# EAGLE board SAME54-Dev (EAGLE 9.5.1)
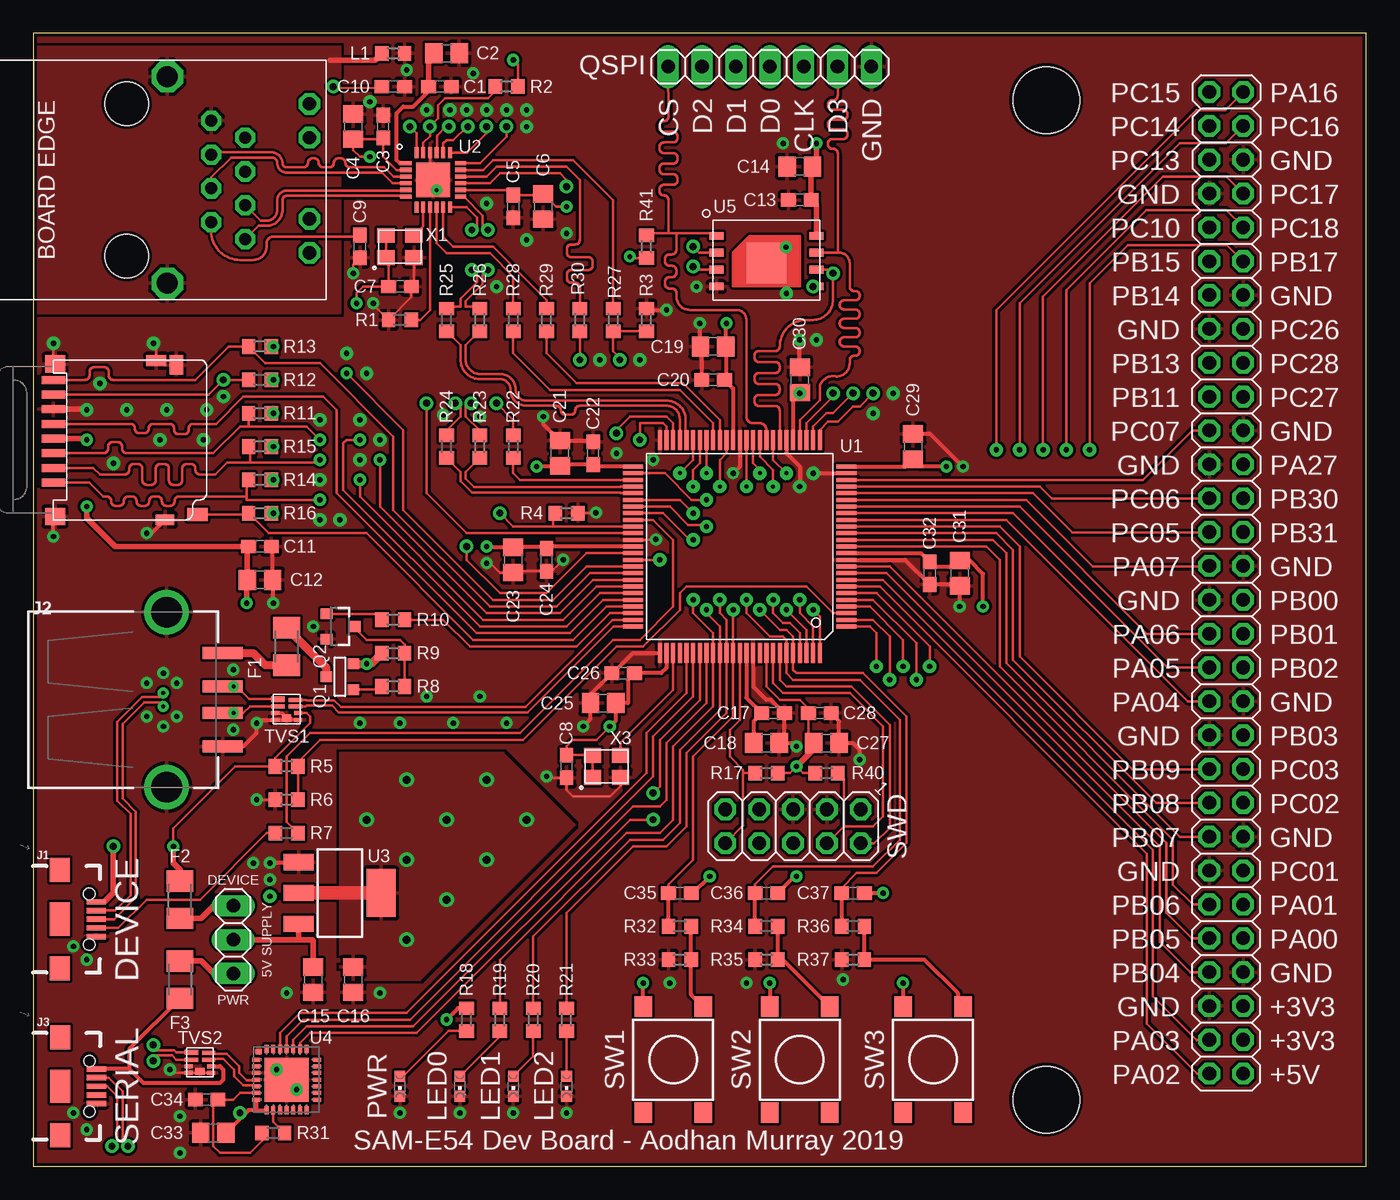
[diagram p3: board, top side]
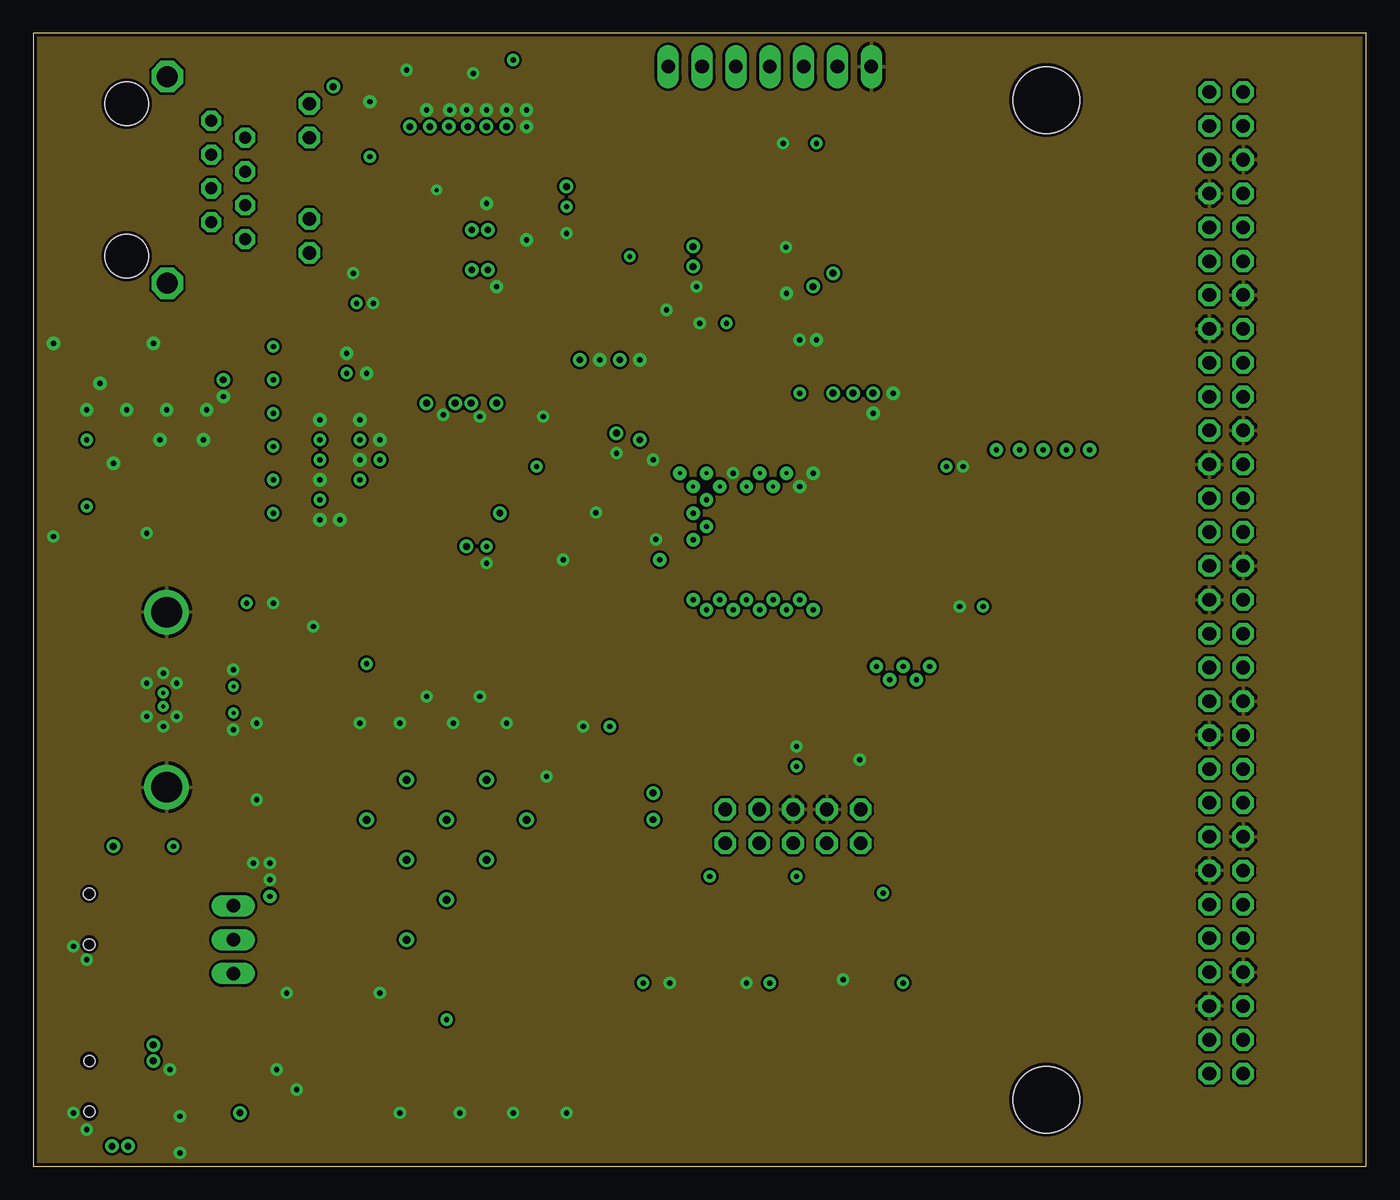
[diagram p4: board, inner layer Route2]
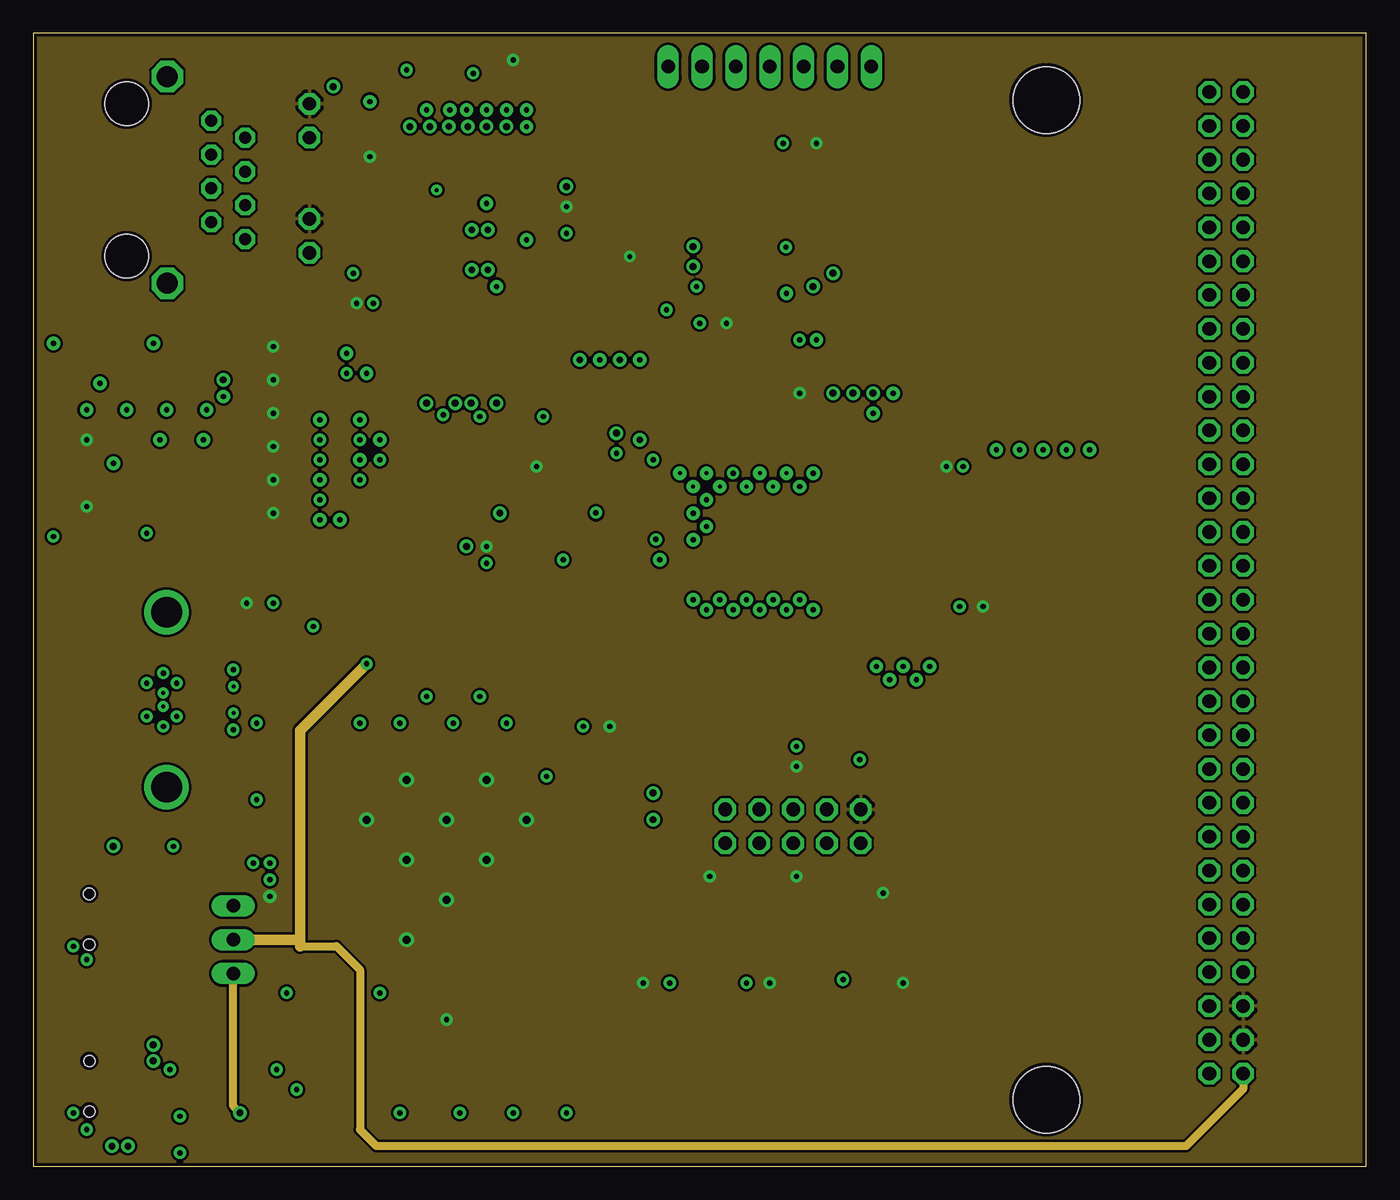
[diagram p5: board, inner layer Route15]
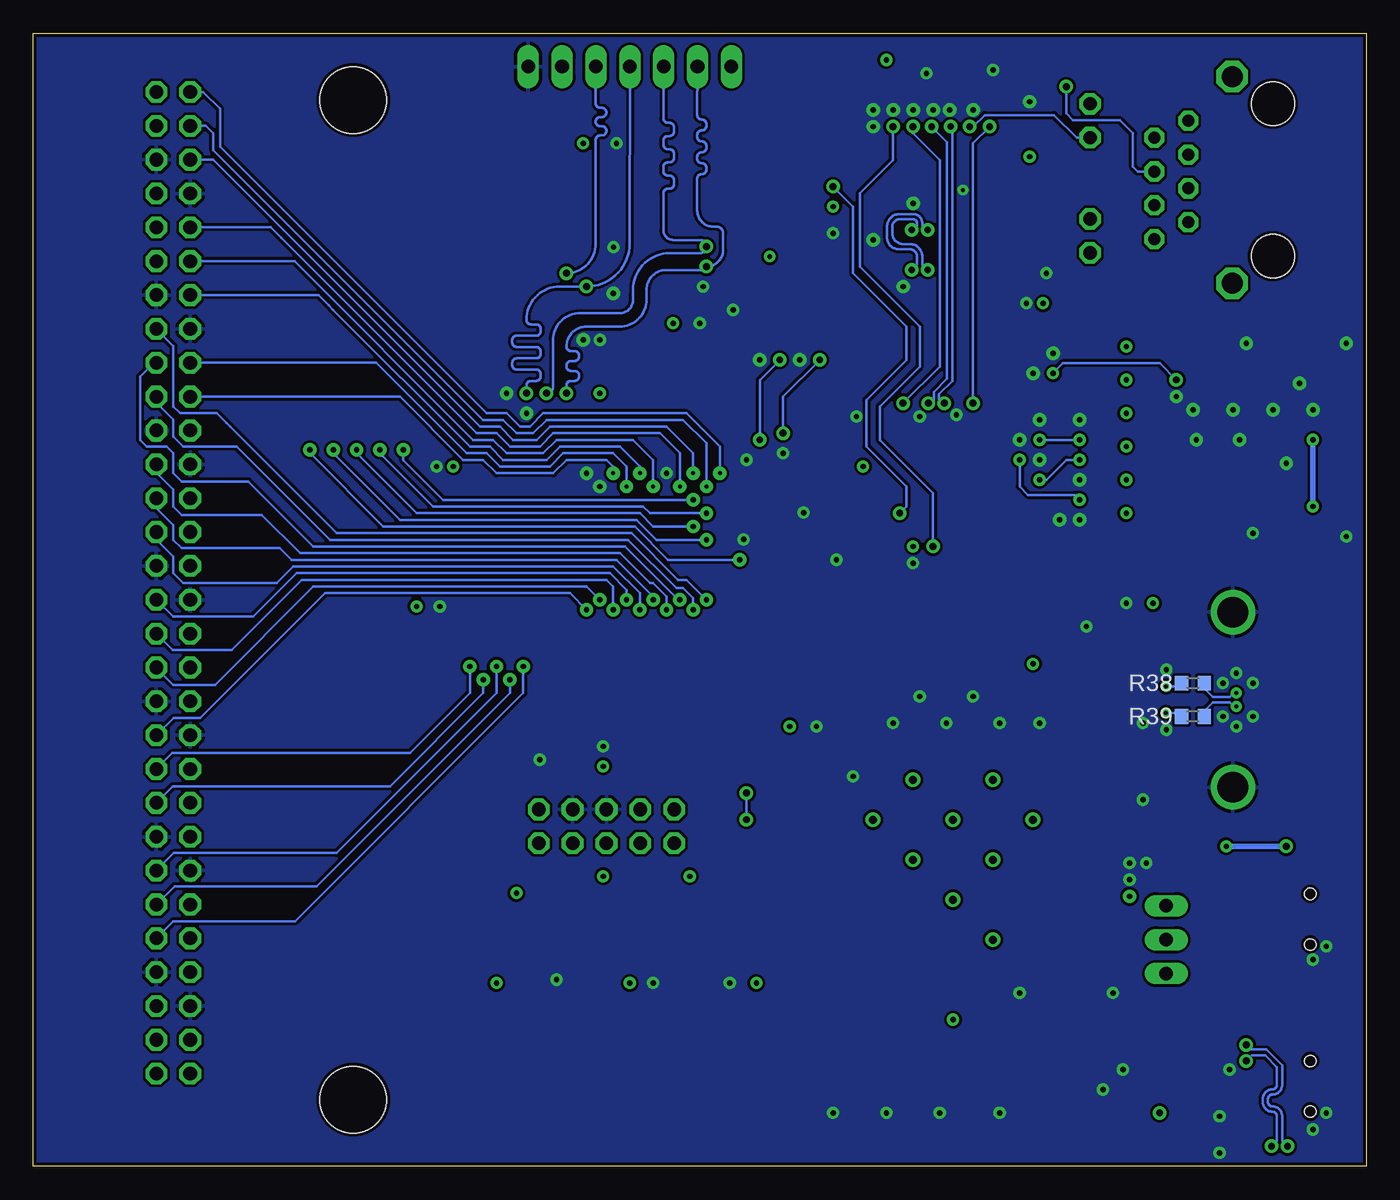
[diagram p6: board, bottom side, seen from below]

Size 100 x 85 mm. Coordinates in mm from the lower left corner, seen from the top.
Outline: 0,0 100,0 100,85 0,85 0,0
Copper layers (1+2*15+16): Top 0.035mm / dielectric 0.2mm / Route2 0.0175mm / dielectric 0.265mm / Route15 0.0175mm / dielectric 0.2mm / Bottom 0.035mm
Design rules "JLC-4Layer *": minimum track width 3.5mil, minimum drill 0.3mm, track to track 3.5mil, track to pad 3.5mil, pad to pad 3.5mil, via to via 3.5mil, smd to smd 0mil, copper to edge 10mil, drill to drill 8mil, minimum pad ring 12mil, minimum via ring 10mil, stop-mask expansion 4mil, vias tented up to drill 0.6mm, thermal gap 10mil
Net classes: 0 default: width 0.2 mm, drill 0.3 mm, clearance 0.191 mm
Holes 5 mm at 76,5 76,80

## Footprints (pad centres in the part's own frame; a part is rotated, then mirrored left to right if it is on the bottom)
C0603 = smd 1.1 x 1: 1 -0.85,0; 2 0.85,0
C0805 = smd 1.3 x 1.5: 1 -0.95,0; 2 0.95,0
M1206 = smd 1.6 x 2: 1 -1.4,0; 2 1.4,0
USB-B-MICRO-SMD_RED_PASTE = smd 1.45 x 0.4: D+ 2.725,0; D- 2.725,0.65; GND 2.725,-1.3; ID 2.725,-0.65; VBUS 2.725,1.3 | smd 1.5 x 1.8: SHIELD1 0,3.685; SHIELD2 0,-3.685 | smd 1.5 x 2.5: SHIELD3 0,0 | hole 0.85: 2.2,1.9; 2.2,-1.9
USB-A-S-SILK-FEMALE = smd 3 x 0.9: D+ 7.212,-1; D- 7.212,1; GND 7.212,-3.5; VBUS 7.212,3.5 | drill 2.311: SHLD1 3,-6.566; SHLD2 3,6.566
1X03 = drill 1.016 long: 1 -2.54,0; 2 0,0; 3 2.54,0
2X30 = drill 1.016 octagon: 1 -38.1,-1.27; 2 -38.1,1.27; 3 -35.56,-1.27; 4 -35.56,1.27; 5 -33.02,-1.27; 6 -33.02,1.27; 7 -30.48,-1.27; 8 -30.48,1.27; 9 -27.94,-1.27; 10 -27.94,1.27; 11 -25.4,-1.27; 12 -25.4,1.27; 13 -22.86,-1.27; 14 -22.86,1.27; 15 -20.32,-1.27; 16 -20.32,1.27; 17 -17.78,-1.27; 18 -17.78,1.27; 19 -15.24,-1.27; 20 -15.24,1.27; 21 -12.7,-1.27; 22 -12.7,1.27; 23 -10.16,-1.27; 24 -10.16,1.27; 25 -7.62,-1.27; 26 -7.62,1.27; 27 -5.08,-1.27; 28 -5.08,1.27; 29 -2.54,-1.27; 30 -2.54,1.27; 31 0,-1.27; 32 0,1.27; 33 2.54,-1.27; 34 2.54,1.27; 35 5.08,-1.27; 36 5.08,1.27; 37 7.62,-1.27; 38 7.62,1.27; 39 10.16,-1.27; 40 10.16,1.27; 41 12.7,-1.27; 42 12.7,1.27; 43 15.24,-1.27; 44 15.24,1.27; 45 17.78,-1.27; 46 17.78,1.27; 47 20.32,-1.27; 48 20.32,1.27; 49 22.86,-1.27; 50 22.86,1.27; 51 25.4,-1.27; 52 25.4,1.27; 53 27.94,-1.27; 54 27.94,1.27; 55 30.48,-1.27; 56 30.48,1.27; 57 33.02,-1.27; 58 33.02,1.27; 59 35.56,-1.27; 60 35.56,1.27
R0603 = smd 1 x 1.1: 1 -0.85,0; 2 0.85,0
CHIPLED_0603 = smd 0.8 x 0.8: A 0,-0.75; C 0,0.75
SOT-23 = smd 0.787 x 0.889: 1 0.025,-1.016; 2 -0.94,1.016; 3 0.991,1.016
SOT23-3 = smd 0.8 x 0.9: 1 -0.95,-1; 2 0.95,-1; 3 0,1.1
1X07 = drill 1.016 long: 1 -7.62,0; 2 -5.08,0; 3 -2.54,0; 4 0,0; 5 2.54,0; 6 5.08,0; 7 7.62,0
TACTILE_SWITCH_SMD_6.2MM_TALL = smd 1.55 x 1.3: A1 -3.975,-2.25; A2 3.975,-2.25; B1 -3.975,2.25; B2 3.975,2.25
2X05 = drill 1.016 octagon: 1 -5.08,-1.27; 2 -5.08,1.27; 3 -2.54,-1.27; 4 -2.54,1.27; 5 0,-1.27; 6 0,1.27; 7 2.54,-1.27; 8 2.54,1.27; 9 5.08,-1.27; 10 5.08,1.27
WDFN8 = smd 0.4 x 1: 1 -0.05,-0.65 | smd 0.3 x 1: 2 0.5,-0.65; 7 0.5,0.65; 8 0,0.65 | smd 0.3 x 0.6: 3 1,-0.85; 4 1.5,-0.85; 5 1.5,0.85; 6 1,0.85 | smd 0.54 x 0.7: PAD 1.38,0
TQFP100 = smd 1.5 x 0.3: 1 -8,6; 2 -8,5.5; 3 -8,5; 4 -8,4.5; 5 -8,4; 6 -8,3.5; 7 -8,3; 8 -8,2.5; 9 -8,2; 10 -8,1.5; 11 -8,1; 12 -8,0.5; 13 -8,0; 14 -8,-0.5; 15 -8,-1; 16 -8,-1.5; 17 -8,-2; 18 -8,-2.5; 19 -8,-3; 20 -8,-3.5; 21 -8,-4; 22 -8,-4.5; 23 -8,-5; 24 -8,-5.5; 25 -8,-6; 51 8,-6; 52 8,-5.5; 53 8,-5; 54 8,-4.5; 55 8,-4; 56 8,-3.5; 57 8,-3; 58 8,-2.5; 59 8,-2; 60 8,-1.5; 61 8,-1; 62 8,-0.5; 63 8,0; 64 8,0.5; 65 8,1; 66 8,1.5; 67 8,2; 68 8,2.5; 69 8,3; 70 8,3.5; 71 8,4; 72 8,4.5; 73 8,5; 74 8,5.5; 75 8,6 | smd 0.3 x 1.5: 26 -6,-8; 27 -5.5,-8; 28 -5,-8; 29 -4.5,-8; 30 -4,-8; 31 -3.5,-8; 32 -3,-8; 33 -2.5,-8; 34 -2,-8; 35 -1.5,-8; 36 -1,-8; 37 -0.5,-8; 38 0,-8; 39 0.5,-8; 40 1,-8; 41 1.5,-8; 42 2,-8; 43 2.5,-8; 44 3,-8; 45 3.5,-8; 46 4,-8; 47 4.5,-8; 48 5,-8; 49 5.5,-8; 50 6,-8; 76 6,8; 77 5.5,8; 78 5,8; 79 4.5,8; 80 4,8; 81 3.5,8; 82 3,8; 83 2.5,8; 84 2,8; 85 1.5,8; 86 1,8; 87 0.5,8; 88 0,8; 89 -0.5,8; 90 -1,8; 91 -1.5,8; 92 -2,8; 93 -2.5,8; 94 -3,8; 95 -3.5,8; 96 -4,8; 97 -4.5,8; 98 -5,8; 99 -5.5,8; 100 -6,8
QFN24 = smd 0.85 x 0.3: 1 -2.05,1.25; 2 -2.05,0.75; 3 -2.05,0.25; 4 -2.05,-0.25; 5 -2.05,-0.75; 6 -2.05,-1.25; 13 2.05,-1.25; 14 2.05,-0.75; 15 2.05,-0.25; 16 2.05,0.25; 17 2.05,0.75; 18 2.05,1.25 | smd 0.3 x 0.85: 7 -1.25,-2.05; 8 -0.75,-2.05; 9 -0.25,-2.05; 10 0.25,-2.05; 11 0.75,-2.05; 12 1.25,-2.05; 19 1.25,2.05; 20 0.75,2.05; 21 0.25,2.05; 22 -0.25,2.05; 23 -0.75,2.05; 24 -1.25,2.05 | smd 2.55 x 2.55: PAD 0,0
SOT223 = smd 1.219 x 2.235: 1 -2.311,-3.099; 2 0,-3.099; 3 2.311,-3.099 | smd 3.6 x 2.2: 4 0,3.099
MLP28 = smd 0.6 x 0.3: 1 -2.3,1.5; 2 -2.3,1; 3 -2.3,0.5; 4 -2.3,0; 5 -2.3,-0.5; 6 -2.3,-1; 7 -2.3,-1.5; 15 2.3,-1.5; 16 2.3,-1; 17 2.3,-0.5; 18 2.3,0; 19 2.3,0.5; 20 2.3,1; 21 2.3,1.5 | smd 0.3 x 0.6: 8 -1.5,-2.3; 9 -1,-2.3; 10 -0.5,-2.3; 11 0,-2.3; 12 0.5,-2.3; 13 1,-2.3; 14 1.5,-2.3; 22 1.5,2.3; 23 1,2.3; 24 0.5,2.3; 25 0,2.3; 26 -0.5,2.3; 27 -1,2.3; 28 -1.5,2.3 | smd 3.3 x 3.3: EXP 0,0 | smd 0.435 x 0.435: M -2.103,2.103
WSON8 = smd 1.05 x 0.57: 1 -3.75,3.81; 2 -3.75,2.54; 3 -3.75,1.27; 4 -3.75,0; 5 3.75,0; 6 3.75,1.27; 7 3.75,2.54; 8 3.75,3.81 | smd 3 x 3: PAD 0,1.75
ASE = smd 1.3 x 1.1: 1 -1.05,-0.825; 2 1.05,-0.825; 3 1.05,0.825; 4 -1.05,0.825
SI-50170-F = drill 0.9 octagon: 1 4.445,8.89; 2 3.175,6.35; 3 1.905,8.89; 4 0.635,6.35; 5 -0.635,8.89; 6 -1.905,6.35; 7 -3.175,8.89; 8 -4.445,6.35 | drill 1 octagon: LED-GREEN+ 2.925,13.72; LED-GREEN- 5.465,13.72; YELLOW+ -5.715,13.72; YELLOW- -3.175,13.72 | drill 1.57 octagon: SHIELD1 -7.755,3.05; SHIELD2 7.755,3.05 | hole 3.25: -5.715,0; 5.715,0
DM3D-SF = smd 0.6 x 1.75: 1 7.7,0; 2 6.6,0; 3 5.5,0; 4 4.4,0; 5 3.3,0; 6 2.2,0; 7 1.1,0; 8 0,0 | smd 1 x 1.55: CDA 10.1,10.8 | smd 0.8 x 1.5: CDB -1.45,7.725 | smd 1.3 x 1.5: SHIELD -1.2,0.125; SHIELD1 10.25,0.125 | smd 0.8 x 1.4: SHIELD2 10.5,8.375 | smd 1.45 x 1: SHIELD3 -1.125,9.225

## Placement (x,y rotation side)
C1  100n  [C0603]  30.5,81 0 top
C2  2.2u  [C0805]  31,83.5 0 top
C3  100n  [C0603]  26.25,78 90 top
C4  22u  [C0805]  24,78 90 top
C5  100n  [C0603]  36,72 270 top
C6  22u  [C0805]  38.25,72 270 top
C7  100n  [C0603]  27.5,66 0 top
C8  100n  [C0603]  40,30 270 top
C9  100n  [C0603]  24.5,69 270 top
C10  100n  [C0603]  27,81 0 top
C11  100n  [C0603]  17,46.5 0 top
C12  10u  [C0805]  17,44 0 top
C13  100n  [C0603]  57.5,72.5 180 top
C14  10u  [C0805]  57.5,75 180 top
C15  10u  [C0805]  21,14 270 top
C16  22u  [C0805]  24,14 270 top
C17  100n  [C0603]  55.5,34 0 top
C18  4.7u  [C0805]  55,31.75 0 top
C19  10u  [C0805]  51,61.5 180 top
C20  100n  [C0603]  51,59 180 top
C21  10u  [C0805]  39.5,53.5 90 top
C22  100n  [C0603]  42,53.5 90 top
C23  10u  [C0805]  36,45.5 270 top
C24  100n  [C0603]  38.5,45.5 270 top
C25  10u  [C0805]  42.75,34.75 180 top
C26  100n  [C0603]  44.25,37 180 top
C27  10u  [C0805]  59.5,31.75 0 top
C28  100n  [C0603]  59,34 0 top
C29  1u  [C0805]  66,54 90 top
C30  1u  [C0805]  57.5,59 90 top
C31  10u  [C0805]  69.5,44.5 270 top
C32  100n  [C0603]  67.25,44.5 270 top
C33  1u  [C0805]  13.5,2.5 180 top
C34  0.1u  [C0603]  13,5 180 top
C35  100n  [C0603]  48.5,20.5 180 top
C36  100n  [C0603]  55,20.5 180 top
C37  100n  [C0603]  61.5,20.5 180 top
F1  1.5A  [M1206]  19,39 90 top
F2  1.5A  [M1206]  11,20 270 top
F3  1.5A  [M1206]  11,14 90 top
J1  [USB-B-MICRO-SMD_RED_PASTE]  1.99,18.53 0 top
J2  USB_A_FEMALE  [USB-A-S-SILK-FEMALE]  7,35 0 top
J3  [USB-B-MICRO-SMD_RED_PASTE]  2,6 0 top
JP2  [1X03]  15,17 90 top
JP4  [2X30]  89.5,42.5 270 top
L1  BLM18PG471SN1D  [R0603]  27,83.5 180 top
LED0  [CHIPLED_0603]  32,6 180 top
LED1  [CHIPLED_0603]  36,6 180 top
LED2  [CHIPLED_0603]  40,6 180 top
PWR  [CHIPLED_0603]  27.5,6 180 top
Q1  [SOT-23]  23,36.75 270 top
Q2  [SOT23-3]  23,40.5 270 top
QSPI  [1X07]  55.25,82.5 0 top
R1  6.49k  [R0603]  27.5,63.5 0 top
R2  4.7k  [R0603]  35.5,81 0 top
R3  1k  [R0603]  46,63.5 270 top
R4  1k  [R0603]  40,49 180 top
R5  30k  [R0603]  19,30 180 top
R6  47k  [R0603]  19,27.5 0 top
R7  330  [R0603]  19,25 180 top
R8  330  [R0603]  27,36 0 top
R9  1k  [R0603]  27,38.5 180 top
R10  1k  [R0603]  27,41 0 top
R11  10k  [R0603]  17,56.5 0 top
R12  100k  [R0603]  17,59 0 top
R13  100k  [R0603]  17,61.5 0 top
R14  100k  [R0603]  17,51.5 0 top
R15  100k  [R0603]  17,54 0 top
R16  10k  [R0603]  17,49 0 top
R17  10k  [R0603]  55,29.5 180 top
R18  330  [R0603]  32.5,11 90 top
R19  330  [R0603]  35,11 90 top
R20  330  [R0603]  37.5,11 90 top
R21  330  [R0603]  40,11 90 top
R22  0R  [R0603]  36,54 90 top
R23  0R  [R0603]  33.5,54 90 top
R24  0R  [R0603]  31,54 90 top
R25  0R  [R0603]  31,63.5 90 top
R26  0R  [R0603]  33.5,63.5 90 top
R27  0R  [R0603]  43.5,63.5 90 top
R28  0R  [R0603]  36,63.5 90 top
R29  0R  [R0603]  38.5,63.5 90 top
R30  0R  [R0603]  41,63.5 90 top
R31  10k  [R0603]  18,2.5 0 top
R32  10k  [R0603]  48.5,18 180 top
R33  100k  [R0603]  48.5,15.5 0 top
R34  10k  [R0603]  55,18 180 top
R35  100k  [R0603]  55,15.5 0 top
R36  10k  [R0603]  61.5,18 180 top
R37  100k  [R0603]  61.5,15.5 0 top
R38  0  [R0603]  13,36.25 180 bottom
R39  0  [R0603]  13,33.75 180 bottom
R40  1k  [R0603]  59.5,29.5 180 top
R41  100k  [R0603]  46,69 270 top
SW1  [TACTILE_SWITCH_SMD_6.2MM_TALL]  48,8 90 top
SW2  [TACTILE_SWITCH_SMD_6.2MM_TALL]  57.5,8 90 top
SW3  [TACTILE_SWITCH_SMD_6.2MM_TALL]  67.5,8 90 top
SWD  [2X05]  57,25.5 180 top
TVS1  EMI2121MT  [WDFN8]  19,35 270 top
TVS2  EMI2121MT  [WDFN8]  12.5,8.5 270 top
U1  ATSAME54N20A  [TQFP100]  53,46.5 180 top
U2  KSZ8091RNA  [QFN24]  30,74 0 top
U3  AP1117  [SOT223]  23,20.5 270 top
U4  CP2102  [MLP28]  19,6.5 0 top
U5  W25N01GV  [WSON8]  55,66 0 top
X1  ASE  [ASE]  27.5,69 0 top
X2  SI-50170-F  [SI-50170-F]  7,74 270 top
X3  ASE  [ASE]  43,30 0 top
X4  DM3D-SF  [DM3D-SF]  1.5,59 270 top

## Tracks (layer width: path | path; a pad name or v marks a point on that pad's centre or on a via)
1-PC15  (via drill 0.3 pad 1)
  Top 0.2: U1.45 49.5,53 v48.5,52
  Bottom 0.2: v48.5,52 48.5,54 51,56.5 61.75,56.5 62.75,55.5 63.5,55.5 64.5,56.5 66,56.5 86,76.5 86,79.33 87.27,80.6 JP4.1
2-PC14  (via drill 0.3 pad 1)
  Top 0.2: U1.44 50,52.75 49.5,52.25 v49.5,51
  Bottom 0.2: v49.5,51 49.5,54.25 51.25,56 61.5,56 62.5,55 63.75,55 64.75,56 66.25,56 86.5,76.25 86.5,77.5 87.06,78.06 JP4.3
3-PC13  (via drill 0.3 pad 1)
  Top 0.2: U1.43 v50.5,52
  Bottom 0.2: v50.5,52 50.5,53.5 52.5,55.5 61.25,55.5 62.25,54.5 64,54.5 65,55.5 66.5,55.5 86.52,75.52 JP4.5
4-PC10  (via drill 0.3 pad 1)
  Top 0.2: U1.40 52,53.5 51.5,53 v51.5,51
  Bottom 0.2: v51.5,51 51.5,53.5 53,55 61,55 62,54 64.25,54 65.25,55 66.75,55 81.42,69.67 82.19,70.44 JP4.9
5-PB15  (via drill 0.3 pad 1)
  Top 0.2: U1.37 v53.5,51
  Bottom 0.2: v53.5,51 53.5,53 55,54.5 60.75,54.5 61.75,53.5 64.5,53.5 65.5,54.5 67,54.5 80.4,67.9 JP4.11
6-PB14  (via drill 0.3 pad 1)
  Top 0.2: v54.5,52 54.5,52.25 54,52.75 U1.36
  Bottom 0.2: v54.5,52 54.5,52.5 56,54 60.5,54 61.5,53 64.75,53 65.75,54 67.25,54 77.5,64.25 77.84,64.59 78.61,65.36 JP4.13
7-PB13  (via drill 0.3 pad 1)
  Top 0.2: U1.35 54.5,53.25 55.5,52.25 v55.5,51
  Bottom 0.2: v55.5,51 55.5,52.5 56.5,53.5 60.25,53.5 61.25,52.5 65,52.5 66,53.5 67.5,53.5 74.28,60.28 JP4.17
8-PB11  (via drill 0.3 pad 1)
  Top 0.2: U1.33 55.5,53 v56.5,52
  Bottom 0.2: v56.5,52 56.5,52.5 57,53 60,53 61,52 65.25,52 66.25,53 67.75,53 72.5,57.75 JP4.19
9-PC07
  Top 0.2: U1.23 83.25,51.5 86.95,55.2 JP4.21
10-PC06
  Top 0.2: U1.22 75.5,51 76.4,50.1 88.21,50.1 JP4.25
11-PC05
  Top 0.2: U1.21 75,50.5 77.94,47.56 88.21,47.56 JP4.27
12-PA07
  Top 0.2: U1.20 74.5,50 79.5,45 88.19,45 JP4.29
13-PA06
  Top 0.2: U1.19 74,49.5 83.56,39.94 88.21,39.94 JP4.33
14-PA05
  Top 0.2: U1.18 73.5,49 85.08,37.42 JP4.35
15-PA04
  Top 0.2: U1.17 73,48.5 86.62,34.88 JP4.37
16-PB09
  Top 0.2: U1.16 72.5,48 74,46.5 74,38.25 82.47,29.78 88.21,29.78 JP4.41
17-PB08
  Top 0.2: U1.15 72.25,47.5 73.5,46.25 73.5,38 84.26,27.24 88.21,27.24 JP4.43
18-PB07
  Top 0.2: U1.14 72,47 73,46 73,37.75 86.03,24.72 JP4.45
19-PB06
  Top 0.2: U1.13 71.5,46.5 72.5,45.5 72.5,37.5 85.5,24.5 85.5,21.12 86.98,19.64 JP4.49
20-PB05
  Top 0.2: U1.10 64.25,45 85,24.25 85,19 86.9,17.1 JP4.51
21-PB04
  Top 0.2: U1.9 64,44.5 84.5,24 84.5,16.83 86.79,14.54 88.21,14.54 JP4.53
22-PA03
  Top 0.2: U1.8 63.75,44 84,23.75 84,12.75 87.29,9.46 87.31,9.48 JP4.57
23-PA02
  Top 0.2: U1.7 63.5,43.5 83.56,23.44 83.56,10.69 87.33,6.92 87.35,6.94 JP4.59
24-PC03  (via drill 0.4 pad 1)
  Top 0.2: U1.6 63.25,43 67.25,39 v67.25,37.5
  Bottom 0.2: v67.25,37.5 67.25,35.5 71.75,31 89.57,31 JP4.42
25-PC02  (via drill 0.4 pad 1)
  Top 0.2: U1.5 63,42.5 66.25,39.25 v66.25,36.5
  Bottom 0.2: v66.25,36.5 66.25,35.5 73.25,28.5 89.53,28.5 JP4.44
26-PC01  (via drill 0.4 pad 1)
  Top 0.2: U1.4 62.75,42 65.25,39.5 v65.25,37.5
  Bottom 0.2: v65.25,37.5 65.25,35.5 77.25,23.5 89.45,23.5 JP4.48
27-PA01  (via drill 0.4 pad 1)
  Top 0.2: U1.2 63,41 64.25,39.75 v64.25,36.5
  Bottom 0.2: v64.25,36.5 64.25,35.5 78.75,21 89.41,21 JP4.50
28-PA00  (via drill 0.4 pad 1)
  Top 0.2: U1.1 62.75,40.5 63.25,40 v63.25,37.5
  Bottom 0.2: v63.25,37.5 63.25,35.5 80.38,18.38 89.5,18.38 JP4.52
29-PB03  (via drill 0.4 pad 1)
  Top 0.2: U1.100 59,41.25 v58.5,41.75
  Bottom 0.2: v58.5,41.75 59.75,43 78.12,43 87.5,33.62 89.48,33.62 JP4.40
30-PB02  (via drill 0.4 pad 1)
  Top 0.2: U1.99 58.5,40.5 57.5,41.5 v57.5,42.5
  Bottom 0.2: v57.5,42.5 58.5,43.5 79,43.5 86.38,36.12 89.5,36.12 90.77,37.4 JP4.36
31-PB01  (via drill 0.4 pad 1)
  Top 0.2: U1.98 58,40.25 v56.5,41.75
  Bottom 0.2: v56.5,41.75 56.5,43.5 57,44 79.88,44 85.12,38.75 89.56,38.75 JP4.34
32-PB00  (via drill 0.4 pad 1)
  Top 0.2: U1.97 57.5,40 56.75,40.75 56.25,40.75 55.5,41.5 v55.5,42.5
  Bottom 0.2: v55.5,42.5 55.5,43.25 56.75,44.5 80.25,44.5 83.5,41.25 89.52,41.25 JP4.32
33-PB31  (via drill 0.4 pad 1)
  Top 0.2: v54.5,41.75 56,40.25 56.5,40.25 57,39.75 U1.96 57,37.25 57.25,37 62.25,37 65.5,33.75 65.5,24.25 63.25,22 61.75,22 60.65,20.9 C37.2
  Top 0.3: R36.2 C37.2
  Bottom 0.2: v54.5,41.75 54.5,43 56.5,45 80.5,45 81.75,43.75 88.75,43.75 89.5,44.5 89.5,45.75 90.77,47.02 JP4.28
34-PB30  (via drill 0.4 pad 1)
  Top 0.2: v53.5,42.5 53.5,41.5 55.25,39.75 56.25,39.75 56.5,39.5 U1.95 56.5,37 57,36.5 62,36.5 65,33.5 65,24.5 63,22.5 55.5,22.5 54.15,21.15 C36.2
  Top 0.3: R34.2 C36.2
  Bottom 0.2: v53.5,42.5 53.5,42.75 56.25,45.5 80.63,45.5 81.5,46.38 88.88,46.38 89.5,47 89.5,48.1 90.77,49.37 JP4.26
35-PA27  (via drill 0.4 pad 1)
  Top 0.2: C35.2 47.65,21.15 49.5,23 49.5,30.75 52.5,33.75 U1.87 v52.5,41.75
  Top 0.3: R32.2 C35.2
  Bottom 0.2: v52.5,41.75 52.5,42.75 53.5,43.75 53.75,43.75 56,46 80,46 82.88,48.88 88.88,48.88 89.5,49.5 89.5,50.77 90.77,52.03 JP4.24
36-PC28  (via drill 0.4 pad 1)
  Top 0.2: R21.2 40,19 45,24 47.5,24 49,25.5 49,31 52,34 U1.86 52,41 51.5,41.5 v51.5,42.5
  Bottom 0.2: v51.5,42.5 51.5,42.38 55.62,46.5 79,46.5 83.88,51.38 88.88,51.38 89.5,52 89.5,53.5 90,54 91.5,54 92,54.5 92,59.25 90.97,60.28 JP4.18
37-PC27  (via drill 0.4 pad 1)
  Top 0.2: R20.2 37.5,17.25 44.75,24.5 47.25,24.5 48.5,25.75 48.5,31.25 51.5,34.25 U1.85 51.5,40.5 50.5,41.5 v50.5,41.75
  Bottom 0.2: v50.5,41.75 50.5,42.62 51.25,43.38 51.75,43.38 55.38,47 77.75,47 84.75,54 88.75,54 89.5,54.75 89.5,56.01 90.77,57.28 JP4.20
38-PC26  (via drill 0.4 pad 1)
  Top 0.2: R19.2 35,15.5 44.5,25 47,25 48,26 48,31.5 51,34.5 U1.84 51,40 49.5,41.5 v49.5,42.5
  Bottom 0.2: v49.5,42.5 51,44 51.62,44 55.12,47.5 77.25,47.5 85.25,55.5 85.5,55.75 86.25,56.5 89,56.5 89.5,57 89.5,61.55 JP4.16
39-PB17  (via drill 0.4 pad 1)
  Top 0.2: U1.65 v47,45.5 | v79.25,53.75 79.25,66.25 82.12,69.12 89.55,69.12 JP4.12
  Bottom 0.2: v47,45.5 52.38,45.5 54.88,48 73.75,48 79.25,53.5 v79.25,53.75
42-PC18  (via drill 0.4 pad 1)
  Top 0.2: U1.58 47.25,49 49.25,47 v49.5,47 | v77.5,53.75 77.5,65.75 83.5,71.75 89.5,71.75 90.77,70.48 JP4.10
  Bottom 0.2: v49.5,47 53.25,47 54.75,48.5 72.5,48.5 77.5,53.5 v77.5,53.75
43-PC17  (via drill 0.4 pad 1)
  Top 0.2: U1.57 47.75,49.5 49.12,48.12 50.38,48.12 v50.5,48 | v75.75,53.75 75.75,65.25 84.75,74.25 89.5,74.25 JP4.8
  Bottom 0.2: v50.5,48 53.5,48 54.5,49 71.25,49 75.75,53.5 v75.75,53.75
44-PC16  (via drill 0.4 pad 1)
  Top 0.2: U1.56 48.5,50 v49.5,49 | v74,53.75 74,64.75 86,76.75 89.46,76.75 JP4.4
  Bottom 0.2: v49.5,49 53.75,49 54.25,49.5 70,49.5 74.12,53.62 v74,53.75
45-PA16  (via drill 0.4 pad 1)
  Top 0.2: U1.52 47.38,52 49.38,50 v50.5,50 | v72.25,53.75 72.25,64.25 87.25,79.25 89.42,79.25 JP4.2
  Bottom 0.2: v50.5,50 69.25,50 72.25,53 v72.25,53.75
+3V3  (via drill 0.35, 0.4, 0.4 pad 1, 0.6)
  Top 0.2: U2.14 35.6,73.25 C5.1 38.15,72.85 C6.1 39.2,72 v40,72 | U2.2 27.25,74.75 26.25,75.75 C3.1 26.15,77.05 C4.1 24,76.25 24.5,75.75 v25.25,75.75 | U1.92 55,36 56,35 57.5,35 58.15,34.35 C28.1 58.15,32.15 C27.1 | R2.2 36.35,82.65 v36,83 | v24.25,64.75 24.25,65.5 24.75,66 C7.1 26.65,67.97 X1.1 X1.4 | R17.1 56.75,29.5 v57.25,30 57.75,29.5 R40.2 | X3.1 X3.4 41.92,30.85 C8.1 40,31.5 40.5,32 42.25,32 v43.25,33 | R15.2 v18,54 | R12.2 v18,59 | R16.2 v18,49 | C30.1 v57.5,58 | R11.2 v18,56.5 | R13.2 v18,61.5 | R14.2 v18,51.5 | R41.2 46,68.12 44.75,68.12 v44.75,68.25
  Top 0.3: U1.77 47.5,37.4 47.1,37 C26.1 44.6,36.5 44.6,34.75 C25.1 43.7,33.45 v43.25,33 | U1.63 38.65,46.5 C24.1 38.9,46.45 C23.1 34.05,46.45 v34,46.5 | U1.51 42.15,52.5 C22.1 39.6,52.65 C21.1 37.8,52.55 v37.75,52.5 | U1.25 65.45,52.5 C29.1 66.55,52.5 v68.5,52.5 | U1.12 66.6,46 C32.1 67.6,45 69.05,45 C31.1 70.25,45.45 71.25,44.45 v71.25,42 | U1.39 52.5,58.35 C20.1 51.95,59.1 C19.1 51.95,63.2 v52,63.25 | C30.1 57,57.95 U1.30 | v31,11 31.85,11.85 R18.2 | C35.1 49.5,20.5 v50.75,21.75 | C36.1 57.1,21.75 v57.25,21.75 | C37.1 v63.75,20.5 | SW1.B2 v45.75,13.75 | v55.25,13.75 SW2.B2 | v65.25,13.75 SW3.B2
  Top 0.4: v4,49.5 4,48.64 6.14,46.5 C11.1 16.05,46.4 C12.1 16,43.95 v16,42.25 | X4.4 3.9,54.6 v4,54.5 | U5.8 58.75,72.1 C13.1 58.35,74.9 C14.1 58.75,75.3 v58.75,76.75 | C27.1 58.55,31.3 v57.25,30
  Top 1: U3.2 U3.4
  Bottom 0.4: v4,54.5 v4,49.5
  other vias: 28,17 31,20 28,23 34,23 37,26 34,29 28,29 31,26 25,26 17.75,20.25
  pour Route15: 0,0 100,0 100,85 0,85
  pour Top (isolate 0.203): 23,14 29,14 40.62,25.62 35.25,31 23,31
+5V  (via drill 0.4)
  Top 0.4: 19.9,17 U3.3 | JP2.2 19.9,17 | 19.9,17 20.9,17 21,16.9 C15.1
  Top 0.6: Q1.2 v25,37.69 25.34,37.69 R9.2
  Route15 0.6: 20,16.5 22.75,16.5 24.5,14.75 24.5,2.75 25.75,1.5 86.48,1.5 90.77,5.79 JP4.60
  Route15 0.8: v25,37.69 20,32.69 20,17 | 20,17 20,16.5 | 20,17 JP2.2
CP2012-CTS  (via drill 0.51)
  Top 0.2: U1.82 50,35 47,32 47,28.5 v46.5,28 | v46.5,26 44.75,26 28.75,10 20.75,10 20,9.25 U4.23
  Bottom 0.2: v46.5,28 v46.5,26
CP2012-RTS
  Top 0.2: U1.83 50.5,34.75 47.5,31.75 47.5,27.5 47,27 45,27 28.5,10.5 20.5,10.5 19.5,9.5 U4.24
CP2012-RX
  Top 0.2: U1.81 49.5,35.25 46.5,32.25 46.5,29.25 28.25,11 20.25,11 19,9.75 U4.25
CP2012-TX
  Top 0.2: U1.80 49,35.5 46,32.5 46,29.5 28,11.5 20,11.5 18.5,10 U4.26
CP2102-D_N
  Top 0.2: U4.5 16.64,6.05 15.75,6.05 15.05,6.75 15.05,7.25 14.25,8.05 13.21,8.05 TVS2.7
CP2102-D_P
  Top 0.2: U4.4 16.64,6.45 16,6.45 15.45,7 15.45,7.5 14.5,8.45 13.21,8.45 TVS2.8
D  (via drill 0.3)
  Top 0.2: v15.02,35.99 v15.01,36 J2.D- 15.25,36 16.2,35.05 TVS1.1
  Bottom 0.2: R38.2 14.11,35.99 v15.02,35.99
D_P  (via drill 0.3)
  Top 0.2: v15.02,34.01 v15.01,34.01 v15,34 J2.D+ 15.75,34 16.25,34.5 TVS1.2
  Bottom 0.2: R39.2 14.1,34 v15.01,34 v15.02,34.01
ETH-LED-Y-  (via drill 0.51 pad 0.4)
  Top 0.2: U2.23 29.25,76.8 29.75,77.3 v29.75,78 30.38,78.62 30.38,79.62 30.88,80.12 34.12,80.12 34.65,80.65 R2.1
  Bottom 0.2: X2.YELLOW- 21.72,77.17 23.42,78.88 28.62,78.88 29.5,78 v29.75,78
GND  (via drill 0.3, 0.4, 0.4 pad 0.4, 0.4 pad 1)
  Top 0.2: U2.22 29.75,74.25 U2.PAD arc-90 30.25,73.75 v30.25,73.25 | X1.2 28.55,66.2 C7.2 28.35,65.2 R1.1 25.5,64.65 v25.5,64.75 | v24,67 24,67.65 C9.2 | X4.SHIELD 1.5,60.33 v1.5,61.75 | v9,61.75 9.22,61.52 X4.CDB 10.4,60.45 X4.SHIELD3 | v34,45.25 34.25,45.25 35,44.5 35.95,44.5 C23.2 36.1,44.65 C24.2 38.9,44.65 v39.75,45.5 | R4.1 42.18,49 v42.21,49.03 | U1.62 v46.71,47.03 | X3.2 44.05,28.55 43.25,27.75 40.5,27.75 40,28.25 C8.2 38.6,29.15 v38.5,29.25 | TVS2.5 12.5,7 TVS2.PAD arc-90 12.38,7 TVS2.4 10.5,7 arc-90 v10.25,7.25 | U4.EXP arc-90 v19.75,5.75 | R6.1 v16.75,27.5
  Top 0.3: C11.2 17.95,46.4 C12.2 18,43.95 v18,42.25 | U1.11 65.4,45.5 C32.2 69.4,43.65 C31.2 v69.5,42 | v62,30.5 62,31.25 61.5,31.75 C27.2 60.45,33.4 C28.2 | U1.90 54,36 55,35 55.35,35 C17.2 56.35,32.15 C18.2 57,31.75 v57.25,31.5 | v69.75,52.5 67.3,54.95 C29.2 | v8.5,47.5 8.88,47.5 X4.SHIELD2 | v1.5,47.25 1.5,48.62 X4.SHIELD1 | v38.25,56.25 38.25,55.7 C21.2 41.9,54.45 C22.2 | v58.5,52 U1.24 | v50,63.25 50,61.55 C19.2 50.15,61.4 C20.2 | R3.1 46.1,64.25 v47.5,64.25 | U1.31 56.5,53.5 57.5,52.5 v57.5,51 | U1.38 53,52.5 v52.5,52 | C30.2 v57.49,62 | U1.76 45,38.5 43.5,37 C26.2 41.8,35.4 C25.2 41.8,33.55 v41.25,33 | U3.1 19.84,22.75 v17.75,22.75 | J2.GND 15.75,31.5 16.75,32.5 v16.75,33.25 17,33.5 TVS1.4 18.88,33.5 TVS1.PAD | TVS1.5 19.12,33.5 TVS1.PAD | TVS1.3 18.62,34 TVS1.PAD
  Top 0.4: X4.6 3.95,56.8 v4,56.75
  other vias: 28,82.25 33,82 40,70 56.25,76.75 26,13 19,13 17.75,21.5 16.5,22.75 11,3.75 11,1 4,2.75 3,4 4,15.5 3,16.5 27.5,4 32,4 36,4 40,4 18.25,7.25 47.75,13.75 53.5,13.75 60.75,14 21,40.5 49.75,66 56.47,68.96 31.25,79.25 32.5,79.25 34,79.25 35.5,79.25 37,78 37,79.25 25.25,79.88 29.5,79.25 34,72.25 37,69.5 34.75,66 30.75,56.38 33.5,56.25 35.5,33.25 31.5,33.25 27.5,33.25 24.5,33.25 33.5,35.25 29.5,35.25 23,48.5 21.5,48.5 21.5,51.5 24.5,53 26,54.5 24.5,56 21.5,56 23.5,61 25,59.5 14.25,57.75 7,56.75 10,56.75 13,56.75 56.5,65.5 64.5,58 63,56.5 58.75,62 46.5,53 9.5,54.5 12.75,54.5 6,52.75 5,58.75 42.5,60.5 45.5,60.5 43.75,53.5 15,32.75 8.5,33.75 9.75,33 10.75,33.75 10.75,36.25 9.75,37 8.5,36.25 15,37.25
  pour Route2: 0,0 100,0 100,85 0,85
  pour Top (isolate 0.2, rank 6): 0,0 100,0 100,85 0,85
  pour Bottom (isolate 0.2, rank 6): 0,0 100,0 100,85 0,85
MCI_CD
  Top 0.2: X4.CDA 16.05,48.9 R16.1 17.65,47.5 25,47.5 33,39.5 40.5,39.5 43,42 U1.72
MCI_CMD  (via drill 0.4)
  Top 0.2: 16.15,55.5 R11.1 | 16.15,55.5 15.5,55.5 13.5,53.5 7,53.5 arc-90 6.66,53.84 6.66,53.99 arc90 6.32,54.33 5.95,54.33 arc90 5.61,53.99 5.61,53.84 arc-90 5.27,53.5 X4.3 | U1.70 42.5,43 40,40.5 33.5,40.5 23.25,50.75 23.25,54.25 23.5,54.5 v24.5,54.5 | v21.5,54.5 20.5,55.5 16.15,55.5
  Bottom 0.2: v24.5,54.5 v21.5,54.5
MCI_D0  (via drill 0.4, 0.51)
  Top 0.2: X4.7 13.15,57.9 v14.25,59 R12.1 | U1.66 41.5,45 39,42.5 34.5,42.5 27.75,49.25 27.75,55.25 v23.5,59.5
  Bottom 0.2: v14.25,59 15.5,60.25 22.75,60.25 v23.5,59.5
MCI_D1
  Top 0.2: U1.67 41.75,44.5 39.25,42 34.25,42 27,49.25 27,54.75 21.5,60.25 17.4,60.25 R13.1 14.65,61.5 12.15,59 6,59 arc-90 5.66,59.34 5.66,59.61 arc90 5.32,59.95 4.56,59.95 arc90 4.22,59.61 4.22,59.34 arc-90 3.88,59 X4.8
MCI_D2  (via drill 0.4)
  Top 0.2: U1.68 42,44 39.5,41.5 34,41.5 26,49.5 v26,53 | v21.5,50 16,50 16,50.25 | X4.1 4.2,51.3 5.25,50.25 5.5,50.25 arc-90 5.84,49.91 5.84,49.89 arc90 6.18,49.55 6.45,49.55 arc90 6.79,49.89 6.79,49.91 arc-90 7.13,50.25 7.4,50.25 arc-90 7.74,49.91 7.74,49.89 arc90 8.08,49.55 8.36,49.55 arc90 8.69,49.89 8.69,49.91 arc-90 9.03,50.25 9.31,50.25 arc-90 9.65,49.91 9.65,49.89 arc90 9.98,49.55 10.26,49.55 arc90 10.6,49.89 10.6,49.91 arc-90 10.94,50.25 16,50.25 | R14.1 16,51.35 16,50.25
  Bottom 0.2: v26,53 26,51 25.38,50.38 21.88,50.38 v21.5,50
MCI_D3  (via drill 0.4)
  Top 0.2: U1.69 42.25,43.5 39.75,41 33.75,41 24.5,50.25 v24.5,51.5 | v21.5,53 21.3,52.8 16.25,52.8 | R15.1 16.25,53.9 16.25,52.8 | 16.25,52.8 14.55,52.8 13.65,51.9 12.5,51.9 arc-90 12.16,52.24 12.16,52.34 arc90 11.82,52.68 11.51,52.68 arc90 11.17,52.34 11.17,51.46 arc-90 10.83,51.12 10.51,51.12 arc-90 10.17,51.46 10.17,52.34 arc90 9.84,52.68 9.52,52.68 arc90 9.18,52.34 9.18,51.46 arc-90 8.84,51.12 8.52,51.12 arc-90 8.19,51.46 8.19,52.34 arc90 7.85,52.68 7.53,52.68 arc90 7.19,52.34 7.19,52.24 arc-90 6.85,51.9 5,51.9 4.5,52.4 X4.2
  Bottom 0.2: v24.5,51.5 24,51.5 22.5,53 v21.5,53
MCI_SDCK
  Top 0.2: U1.71 42.75,42.5 40.25,40 33.25,40 22.75,50.5 22.75,56.75 21.75,57.75 15.75,57.75 13.7,55.7 12,55.7 arc90 11.66,55.36 11.66,55.26 arc-90 11.32,54.92 10.89,54.92 arc-90 10.56,55.26 10.56,55.36 arc90 10.22,55.7 9,55.7 arc90 8.66,55.36 8.66,55.34 arc-90 8.32,55 7.95,55 arc-90 7.61,55.34 7.61,55.36 arc90 7.28,55.7 X4.5
MCU_RESET
  Top 0.2: U1.88 53,33.5 52.25,32.75 52.25,30.75 53.25,29.75 53.25,29.5 | 53.25,29.5 R17.2 | SWD.10 53.25,25.56 53.25,29.5
N$1
  Top 0.2: U2.8 29.25,70.53 X1.3
N$2
  Top 0.6: J2.VBUS 16.5,38.5 17.4,37.6 F1.1
N$3
  Top 0.6: F1.2 21.98,37.42 Q1.1
N$4  (via drill 0.4 pad 0.4, 0.51)
  Top 0.2: TVS1.6 20.5,34 20.75,33.75 20.75,33.25 18.15,30.65 R5.2 15.15,30 10.5,25.35 v10.5,24
  Top 0.4: J1.VBUS 5.33,19.83 6,20.5 v6,24 | F2.1 11,22.25 10.5,22.75 v10.5,24
  Bottom 0.4: v10.5,24 v6,24
N$5
  Top 0.3: 7.2,7.3 J3.VBUS | 7.2,7.3 8.25,6.25 14,6.25 14.25,6.5 14.25,7.25 14,7.5 TVS2.6 | F3.1 7.2,8.8 7.2,7.3
N$6
  Top 0.2: X2.2 13.35,70.15 arc90 15.5,68 16.5,68 arc90 17.5,69 17.5,69.25 arc-90 18,69.75 24.4,69.75 C9.1
N$7  (via drill 0.51 pad 0.4)
  Top 0.2: C10.1 26.04,80.89 22.6,80.9 v22.5,81
  Bottom 0.2: X2.5 17.14,74.64 17.5,75 17.5,77.5 18.5,78.5 22,78.5 22.5,79 v22.5,81
N$8
  Top 0.2: U4.6 15.5,5.5 15,5 C34.1 13.5,4.65 13.5,1.5 14,1 16.25,1 17.15,1.9 R31.1
N$9
  Top 0.2: R18.1 31.15,10.15 27.75,6.75 PWR.A
N$10  (via drill 0.51)
  Top 0.2: 16.7,4.25 16.75,4.2
  Top 0.3: U4.8 16.75,4.2 16.15,4.2 15.95,4 v15.5,4 15.5,3.55 C33.1 | U4.7 16.7,4.25
  Top 0.4: F3.2 12.6,15.4 13.54,14.46 JP2.1
  Route15 0.6: v15.5,4 15,4.5 JP2.1
N$11
  Top 0.2: R8.1 25.91,35.76 Q1.3
N$12
  Top 0.2: R8.2 R9.1 27.85,39.15 27.5,39.5 25,39.5 24.1,40.4 Q2.3
N$13
  Top 0.2: R1.2 29,63.5 29.75,64.25 U2.9
N$14
  Top 0.2: LED0.A 35,9.75 R19.1
N$15
  Top 0.2: Q2.1 25.7,41.45 R10.1
N$16
  Top 0.3: 29.5,80.75 29.5,80.5 28.5,79.5 27.75,79.5 27.25,79 27.25,75.5 27.5,75.25 U2.1
  Top 0.4: C2.1 29.65,83.1 C1.1 29.5,80.75
N$17
  Top 0.3: U1.89 53.5,35.15 C17.1 54.05,33.4 C18.1
N$18
  Top 0.2: LED1.A 37.5,8.25 R20.1
N$19
  Top 0.2: LED2.A R21.1
N$20
  Top 0.2: U4.9 18,3.35 R31.2
N$21
  Top 0.3: SW1.A2 49.35,12.88 R33.2 R32.1
N$22
  Top 0.3: SW2.A2 56.23,15.5 R35.2 R34.1
N$23
  Top 0.3: SW3.A2 69.35,12.38 69.35,13 66.85,15.5 R37.2 R36.1
PHY_CRS_DV  (via drill 0.51)
  Top 0.2: U2.15 34.25,73.75 35,74.5 39.5,74.5 40,74 v40,73.5 | v35,49 36,48 39,48 | 39,48 U1.60 | R4.2 39,48.85 39,48
  Bottom 0.2: v40,73.5 38.5,72 38.5,67 34.5,63 34.5,60.5 37.5,57.5 37.5,54 34.5,51 34.5,49.5 v35,49
PHY_INT  (via drill 0.51)
  Top 0.2: U2.18 33.5,75.25 35.5,77.25 v35.5,78 | U1.64 41.5,46 38.5,43 35,43 32.5,45.5 v32.5,46.5
  Bottom 0.2: v35.5,78 35.5,75.5 38,73 38,67.5 33.5,63 33.5,60 36.5,57 36.5,54.5 32.5,50.5 v32.5,46.5
PHY_MDC
  Top 0.2: R29.1 38.5,61 40.75,58.75 48.75,58.75 51.5,56 U1.41
PHY_MDIO
  Top 0.2: U1.42 51,55.75 48.5,58.25 38.75,58.25 36,61 R28.1
PHY_PIN_MDC
  Top 0.2: U2.11 30.75,69.75 31.5,69 34.5,69 38.5,65 R29.2
PHY_PIN_MDIO
  Top 0.2: U2.10 30.25,69.25 31,68.5 34.25,68.5 36,66.75 R28.2
PHY_PIN_REFCLK
  Top 0.2: U2.16 34,74.25 34.75,75 40,75 41,74 41,69.5 arc-90 40.66,69.16 40.37,69.16 arc90 40.03,68.82 40.03,68.54 arc90 40.37,68.2 41.63,68.2 arc-90 41.97,67.86 41.97,67.58 arc-90 41.63,67.24 40.37,67.24 arc90 40.03,66.91 40.03,66.62 arc90 40.37,66.28 40.66,66.28 arc-90 41,65.94 R30.2
PHY_PIN_RXD_N  (via drill 0.51)
  Top 0.2: R26.2 33.35,64.5 32.45,64.5 32.45,64.92 33.7,66.17 33.7,66.84 v34.1,67.25 | U2.12 32.52,71.95 33.3,71.17 33.3,70.25 v32.9,70.25
  Bottom 0.2: v34.1,67.25 33.7,67.66 33.7,68.25 arc-90 34.25,68.81 35.08,68.81 arc90 35.95,69.67 35.95,70.5 arc90 35,71.44 34,71.44 arc90 33.3,70.75 33.3,70.25 v32.9,70.25
PHY_PIN_RXD_P  (via drill 0.51)
  Top 0.2: U2.13 32.05,72.73 32.3,72.73 33.7,71.33 33.7,70.25 v34.1,70.25 | R25.2 31.15,64.5 32.05,64.5 32.05,65.08 33.3,66.33 33.3,66.84 v32.9,67.25
  Bottom 0.2: v32.9,67.25 33.3,67.66 33.3,68.25 arc-90 34.25,69.19 34.75,69.19 arc90 35.55,70 35.55,70.5 arc90 35,71.06 34,71.06 arc90 33.7,70.75 33.7,70.25 v34.1,70.25
PHY_PIN_RXER
  Top 0.2: U2.17 33.75,74.75 34.5,75.5 40.5,75.5 43.5,72.5 R27.2
PHY_PIN_TXD_N  (via drill 0.51)
  Top 0.2: R24.2 31,55.2 32.05,56.25 32.05,57.25 v31.65,57.25 | v31.18,78.01 30.99,78.01 30.3,77.33 30.3,76.5 30.25,76.44 U2.21
  Bottom 0.2: v31.65,57.25 32.05,57.25 32.05,57.92 31.05,58.92 31.05,77.89 v31.18,78.01
PHY_PIN_TXD_P  (via drill 0.51)
  Top 0.2: R23.2 33.5,55.2 32.45,56.25 32.45,57.25 v32.85,57.25 | v32.6,78 32.53,78 31.49,77 31,77 30.75,76.75 U2.20
  Bottom 0.2: v32.85,57.25 32.45,57.25 32.45,58.08 31.45,59.08 31.45,76.84 v32.6,78
PHY_PIN_TXEN  (via drill 0.51)
  Top 0.2: U2.19 32.55,76.05 34,77.5 v34,78 | v34.75,57.25 36,56 R22.2
  Bottom 0.2: v34,78 34,77.5 32,75.5 32,60 v34.75,57.25
PHY_REFCLK  (via drill 0.51)
  Top 0.2: U1.48 48,55.75 47.5,56.25 44.75,56.25 43.75,55.25 v43.75,55 | v41,60.5 R30.1
  Bottom 0.2: v43.75,55 43.75,57.75 v41,60.5
PHY_RST  (via drill 0.51)
  Top 0.2: U2.24 28.75,77.5 v28.25,78 | v29.5,57.25 29.5,50.5 32.5,47.5 U1.61
  Bottom 0.2: v28.25,78 29.5,76.75 v29.5,57.25
PHY_RXD_N
  Top 0.2: R26.1 32.45,61.59 32.45,60.5 arc90 33.5,59.45 35,59.45 arc-90 36.2,58.25 arc90 37,57.45 47.5,57.45 arc-90 48.95,56 48.95,54.8 U1.46
PHY_RXD_P
  Top 0.2: R25.1 32.05,61.59 32.05,60.5 arc90 33.5,59.05 35,59.05 arc-90 35.8,58.25 arc90 37,57.05 39.24,57.05 arc-90 39.58,56.72 arc90 39.92,56.38 40.32,56.38 arc90 40.66,56.72 arc-90 41,57.05 47.5,57.05 arc-90 48.5,56.05 U1.47
PHY_RXER  (via drill 0.51)
  Top 0.2: U1.49 47.5,55.5 47.25,55.75 45.5,55.75 v45.5,54.5 | v44,60.5 44,60.65 43.5,61.15 R27.1 R3.2
  Bottom 0.2: v45.5,54.5 45.5,59 v44,60.5
PHY_TXD_N
  Top 0.2: R24.1 32.05,52.09 32.05,51.42 32.92,50.55 44,50.55 44.05,50.5 U1.55
PHY_TXD_P
  Top 0.2: R23.1 32.45,52.09 32.45,51.58 33.08,50.95 44,50.95 44.05,51 U1.54
PHY_TXEN
  Top 0.2: U1.53 36.5,51.5 36,52 R22.1
PRE-TVS-D_N  (via drill 0.51)
  Top 0.2: v9,7.9 9,8.3 10.42,8.3 10.72,8 TVS2.2 | v7.1,1.5 6.7,1.91 6.7,5.62 5.67,6.65 J3.D-
  Bottom 0.2: v7.1,1.5 6.7,1.91 6.7,3.75 arc-90 7.03,4.09 arc90 7.76,4.82 7.76,5.04 arc90 7.03,5.77 arc-90 6.7,6.11 6.7,7.42 7.58,8.3 8.59,8.3 v9,7.9
PRE-TVS-D_P  (via drill 0.51)
  Top 0.2: v9,9.1 9,8.7 10.58,8.7 10.73,8.55 TVS2.1 | v5.9,1.5 6.3,1.91 6.3,5.25 5.55,6 J3.D+
  Bottom 0.2: v5.9,1.5 6.3,1.91 6.3,3.75 arc-90 7.03,4.48 arc90 7.37,4.82 7.37,5.04 arc90 7.03,5.38 arc-90 6.3,6.11 6.3,7.58 7.49,8.76 8.66,8.76 v9,9.1
QSPI_CLK  (via drill 0.51)
  Top 0.2: U5.6 59.73,67.27 v60,67 60,65 arc-90 58.5,63.5 58,63.5 arc90 56,61.5 arc-90 55.66,61.16 54.44,61.16 arc90 54.1,60.82 54.1,60.68 arc90 54.44,60.34 55.66,60.34 arc-90 56,60 56,59.85 arc-90 55.66,59.51 54.44,59.51 arc90 54.1,59.18 54.1,59.03 arc90 54.44,58.69 55.66,58.69 arc-90 56,58.35 56,58.2 arc-90 55.66,57.87 54.44,57.87 arc90 54.1,57.53 54.1,57.38 arc90 54.44,57.04 55.66,57.04 arc-90 56,56.7 U1.32
  Bottom 0.2: QSPI.5 57.81,79.75 arc-90 57.47,79.41 57.34,79.41 arc90 57,79.07 57,79.06 arc90 57.34,78.72 57.47,78.72 arc-90 57.81,78.38 57.81,78.37 arc-90 57.47,78.03 57.34,78.03 arc90 57,77.69 57,77.68 arc90 57.34,77.34 57.47,77.34 arc-90 57.81,77 57.81,69.19 arc90 v60,67
QSPI_CS
  Top 0.2: U1.34 55,55.25 arc90 54.5,55.75 54,55.75 arc-90 53.5,56.25 53.5,63.5 arc90 52.75,64.25 49.25,64.25 arc-90 48.25,65.25 48.25,65.51 arc90 47.91,65.85 47.73,65.85 arc-90 47.4,66.19 47.4,66.37 arc-90 47.73,66.7 47.91,66.7 arc90 48.25,67.04 48.25,67.22 arc90 47.91,67.56 47.73,67.56 arc-90 47.4,67.9 47.4,68.07 arc-90 47.73,68.41 47.91,68.41 arc90 48.25,68.75 48.25,70 | 48.25,70 48.62,70 51.06,70 U5.1 | QSPI.1 47.65,78.74 arc-90 47.31,78.4 47.31,78.4 arc90 46.97,78.06 46.97,77.95 arc90 47.31,77.61 47.99,77.61 arc-90 48.33,77.27 48.33,77.15 arc-90 47.99,76.81 47.31,76.81 arc90 46.97,76.47 46.97,76.36 arc90 47.31,76.02 47.99,76.02 arc-90 48.33,75.68 48.33,75.56 arc-90 47.99,75.22 47.31,75.22 arc90 46.97,74.89 46.97,74.77 arc90 47.31,74.43 47.99,74.43 arc-90 48.33,74.09 48.33,73.97 arc-90 47.99,73.63 47.31,73.63 arc90 46.97,73.3 46.97,73.18 arc90 47.31,72.84 47.31,72.84 arc-90 47.65,72.5 47.65,70.5 47.65,70.35 47.65,70 48.25,70 | R41.1 46.15,70 48.25,70
QSPI_D0  (via drill 0.51)
  Top 0.2: U1.26 59,55.25 59.62,55.88 60.38,55.88 61.5,57 62,57 v63,58 | U5.5 v58.5,66
  Bottom 0.2: v63,58 63,58.58 arc90 62.66,58.92 62.27,58.92 arc-90 61.93,59.26 61.93,59.43 arc-90 62.27,59.77 63.73,59.77 arc90 64.07,60.11 64.07,60.28 arc90 63.73,60.62 62.27,60.62 arc-90 61.93,60.95 61.93,61.13 arc-90 62.27,61.47 63.73,61.47 arc90 64.07,61.8 64.07,61.98 arc90 63.73,62.31 62.27,62.31 arc-90 61.93,62.65 61.93,62.82 arc-90 62.27,63.16 62.66,63.16 arc90 63,63.5 arc90 60.5,66 v58.5,66 arc-90 55.27,69.23 QSPI.4
QSPI_D1  (via drill 0.51)
  Top 0.2: U5.2 49.96,68.54 v49.5,69 | U1.27 58.5,55.5 59.5,56.5 60,56.5 v61.5,58
  Bottom 0.2: v61.5,58 arc-90 61,58.5 61,62 arc90 59,64 56,64 arc-90 55,65 55,65.25 55,65.5 55,65.75 arc90 52.25,68.5 50,68.5 arc-90 v49.5,69 arc-90 50,69.5 52,69.5 arc90 52.73,70.23 52.73,73 arc90 52.39,73.34 52.27,73.34 arc-90 51.94,73.68 51.94,73.99 arc-90 52.27,74.33 52.39,74.33 arc90 52.73,74.67 52.73,74.98 arc90 52.39,75.32 52.27,75.32 arc-90 51.94,75.66 51.94,75.97 arc-90 52.27,76.31 52.39,76.31 arc90 52.73,76.64 52.73,76.96 arc90 52.39,77.3 52.27,77.3 arc-90 51.94,77.63 51.94,77.95 arc-90 52.27,78.28 52.39,78.28 arc90 52.73,78.62 QSPI.3
QSPI_D2  (via drill 0.51)
  Top 0.2: U5.3 49.73,67.27 v49.5,67.5 | U1.28 58,55.75 60,57.75 v60,58
  Bottom 0.2: v60,58 60,58.59 arc90 59.66,58.92 59.39,58.92 arc-90 59.05,59.26 59.05,59.33 arc-90 59.39,59.67 59.66,59.67 arc90 60,60.01 60,60.08 arc90 59.66,60.42 59.39,60.42 arc-90 59.05,60.75 59.05,60.82 arc-90 59.39,61.16 59.66,61.16 arc90 60,61.5 arc90 58.5,63 56,63 arc-90 54,65 54,65.75 arc90 52.5,67.25 49.75,67.25 v49.5,67.5 arc-90 48.25,68.75 48.25,70 arc-90 48.75,70.5 49,70.5 arc90 50.19,71.69 50.19,74.1 arc90 49.85,74.43 49.84,74.43 arc-90 49.5,74.77 49.5,74.92 arc-90 49.84,75.25 49.85,75.25 arc90 50.19,75.59 50.19,75.73 arc90 49.85,76.07 49.84,76.07 arc-90 49.5,76.41 49.5,76.56 arc-90 49.84,76.89 49.85,76.89 arc90 50.19,77.23 50.19,77.38 arc90 49.85,77.71 49.84,77.71 arc-90 49.5,78.05 49.5,78.19 arc-90 49.84,78.53 49.85,78.53 arc90 50.19,78.87 QSPI.2
QSPI_D3
  Top 0.2: U1.29 57.5,56 59,57.5 59,58.5 arc-90 60.25,59.25 arc90 61.25,60.25 61.25,60.47 arc-90 61.59,60.81 61.67,60.81 arc90 62,61.15 62,61.16 arc90 61.67,61.5 60.83,61.5 arc-90 60.5,61.84 60.5,61.86 arc-90 60.83,62.2 61.67,62.2 arc90 62,62.53 62,62.55 arc90 61.67,62.89 60.83,62.89 arc-90 60.5,63.23 60.5,63.24 arc-90 60.83,63.58 61.67,63.58 arc90 62,63.92 62,63.94 arc90 61.67,64.28 60.83,64.28 arc-90 60.5,64.61 60.5,64.63 arc-90 60.83,64.97 61.67,64.97 arc90 62,65.31 62,65.32 arc90 61.67,65.66 61.59,65.66 arc-90 61.25,66 61.25,67.75 arc90 60.46,68.54 | 60.46,68.54 U5.7 | QSPI.6 60.35,80.32 arc-90 60.01,79.98 59.95,79.98 arc90 59.61,79.65 59.61,79.59 arc90 59.95,79.25 60.75,79.25 arc-90 61.09,78.92 61.09,78.86 arc-90 60.75,78.53 59.95,78.53 arc90 59.61,78.19 59.61,78.14 arc90 59.95,77.8 60.75,77.8 arc-90 61.09,77.46 61.09,77.41 arc-90 60.75,77.07 59.95,77.07 arc90 59.61,76.73 59.61,76.68 arc90 59.95,76.34 60.01,76.34 arc-90 60.35,76 60.35,68.65 arc90 60.46,68.54
RJ45-GND
  Top 0.4: X2.8 13.5,78.5 13.6,78.5 | L1.2 25.65,83 22.25,83
  pour Top: 0,84 23,84 23,64 0,64
RX_N
  Top 0.2: X2.6 13.38,75.91 13.54,76.07 17.88,76.07 arc-90 18.7,75.25 arc90 19,74.94 20.27,74.94 arc90 20.6,75.28 arc-90 20.94,75.62 21.07,75.62 arc-90 21.41,75.28 arc90 21.75,74.94 22.21,74.94 arc90 22.55,75.28 arc-90 22.89,75.62 23.07,75.62 arc-90 23.41,75.28 arc90 23.75,74.94 26.33,74.94 27.03,74.25 U2.3
RX_P
  Top 0.2: X2.4 13.35,74.2 14.83,75.68 17.88,75.68 arc-90 18.3,75.25 arc90 19,74.56 26.17,74.56 26.97,73.75 U2.4
SWDCLK
  Top 0.2: U1.93 55.5,36.25 56.25,35.5 61.25,35.5 63.75,33 63.75,26.25 63,25.5 60.81,25.5 | 60.81,25.5 SWD.4 | 60.81,25.5 60.81,29.04 R40.1
SWDIO
  Top 0.2: U1.94 56,36.5 56.5,36 61.38,36 64.25,33.12 64.25,25.4 63.08,24.23 SWD.2
TX_N
  Top 0.2: X2.3 17.04,70.94 17.5,70.94 arc90 18.3,71.75 18.3,72.5 arc-90 19,73.19 27.5,73.19 27.55,73.25 U2.5
TX_P
  Top 0.2: X2.1 16.89,70.56 17.5,70.56 arc90 18.7,71.75 18.7,72.5 arc-90 19,72.81 27.5,72.81 27.55,72.75 U2.6
USB-D_N
  Top 0.2: U1.74 43.47,41 36.92,34.45 23.08,34.45 22.58,34.95 20.5,34.95 20.45,35 TVS1.8
USB-D_P
  Top 0.2: U1.75 43.53,40.5 37.08,34.05 22.92,34.05 22.42,34.55 20.5,34.55 20.45,34.5 TVS1.7
USB_DEV_N  (via drill 0.3)
  Top 0.2: v9.75,35.5 9.75,35.2 8.17,35.2 6.3,33.33 6.3,27.42 7.3,26.42 7.3,20.33 6.15,19.18 J1.D-
  Bottom 0.2: R38.1 12.15,35.84 11.5,35.2 10.25,35.2 9.95,35.5 v9.75,35.5
USB_DEV_P  (via drill 0.3)
  Top 0.2: v9.75,34.5 9.75,34.8 8.33,34.8 6.7,33.17 6.7,27.58 7.7,26.58 7.7,20.17 6.06,18.53 J1.D+
  Bottom 0.2: R39.1 12.15,34.16 11.5,34.8 10.25,34.8 9.95,34.5 v9.75,34.5
USB_ID
  Top 0.2: U1.59 46.5,48.5 48,47 48,42 45.5,39.5 43.5,39.5 36.5,32.5 20.75,32.5 19,30.75 19,25.85 R7.1
V_USB
  Top 0.4: F2.2 12.6,18.6 13.54,19.54 JP2.3
VBUS_CTRL
  Top 0.2: U1.73 43.25,41.5 40.75,39 32.75,39 30.75,41 R10.2
VBUS_DETECT
  Top 0.2: U1.3 60,41.5 58,43.5 49,43.5 48.5,43 48.5,41.75 45.75,39 43.75,39 36.75,32 21.5,32 19.85,30.35 R5.1 R6.2
VBUS_HOST_EN
  Top 0.2: J1.ID 6.38,17.88 8.5,20 12.5,20 17.5,25 R7.2
XIN
  Top 0.2: X3.3 44.05,31.8 48,35.75 U1.78

## Text on the board
tNames: PC15 | PA16 | CS | D2 | D1 | D0 | CLK | D3 | GND | PC14 | PC16 | PC13 | GND | GND | PC17 | PC10 | PC18 | PB15 | PB17 | PB14 | GND | GND | PC26 | PB13 | PC28 | PB11 | PC27 | PC07 | GND | GND | PA27 | PC06 | PB30 | PC05 | PB31 | PA07 | GND | GND | PB00 | PA06 | PB01 | PA05 | PB02 | PA04 | GND | GND | PB03 | PB09 | PC03 | 1 | PB08 | PC02 | PB07 | GND | DEVICE | GND | PC01 | PB06 | PA01 | DEVICE | 5V SUPPLY | PB05 | PA00 | PB04 | GND | PWR | GND | +3V3 | PA03 | +3V3 | SW1 | SW2 | SW3 | PA02 | +5V | SERIAL | SAM-E54 Dev Board - Aodhan Murray 2019